# EAGLE design EagleVersion1.PowerPatch (EAGLE 9.6.2)
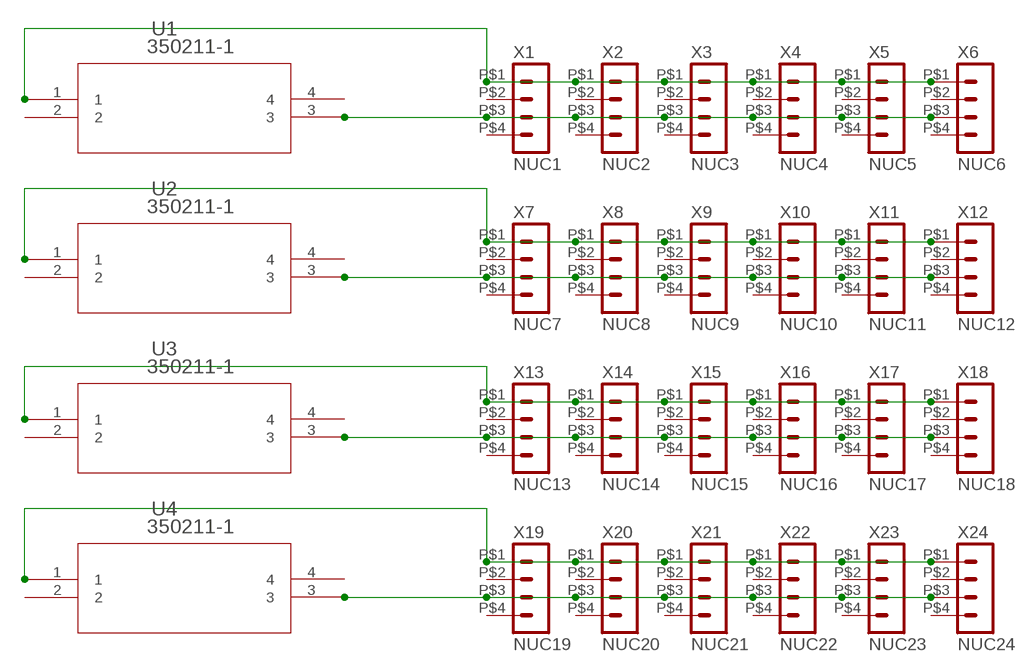
[diagram p0: schematic, sheet 1]

## Parts
U1  350211-1  [350211-1]
U2  350211-1  [350211-1]
U3  350211-1  [350211-1]
U4  350211-1  [350211-1]
X1  NUC1  HEADER_POS4_43045-0412  [43045-0412]
X2  NUC2  HEADER_POS4_43045-0412  [43045-0412]
X3  NUC3  HEADER_POS4_43045-0412  [43045-0412]
X4  NUC4  HEADER_POS4_43045-0412  [43045-0412]
X5  NUC5  HEADER_POS4_43045-0412  [43045-0412]
X6  NUC6  HEADER_POS4_43045-0412  [43045-0412]
X7  NUC7  HEADER_POS4_43045-0412  [43045-0412]
X8  NUC8  HEADER_POS4_43045-0412  [43045-0412]
X9  NUC9  HEADER_POS4_43045-0412  [43045-0412]
X10  NUC10  HEADER_POS4_43045-0412  [43045-0412]
X11  NUC11  HEADER_POS4_43045-0412  [43045-0412]
X12  NUC12  HEADER_POS4_43045-0412  [43045-0412]
X13  NUC13  HEADER_POS4_43045-0412  [43045-0412]
X14  NUC14  HEADER_POS4_43045-0412  [43045-0412]
X15  NUC15  HEADER_POS4_43045-0412  [43045-0412]
X16  NUC16  HEADER_POS4_43045-0412  [43045-0412]
X17  NUC17  HEADER_POS4_43045-0412  [43045-0412]
X18  NUC18  HEADER_POS4_43045-0412  [43045-0412]
X19  NUC19  HEADER_POS4_43045-0412  [43045-0412]
X20  NUC20  HEADER_POS4_43045-0412  [43045-0412]
X21  NUC21  HEADER_POS4_43045-0412  [43045-0412]
X22  NUC22  HEADER_POS4_43045-0412  [43045-0412]
X23  NUC23  HEADER_POS4_43045-0412  [43045-0412]
X24  NUC24  HEADER_POS4_43045-0412  [43045-0412]

## Nets
N$1: U1.1 X1.P$1 X2.P$1 X3.P$1 X4.P$1 X5.P$1 X6.P$1
N$2: U1.3 X1.P$3 X2.P$3 X3.P$3 X4.P$3 X5.P$3 X6.P$3
N$3: U2.1 X7.P$1 X8.P$1 X9.P$1 X10.P$1 X11.P$1 X12.P$1
N$4: U2.3 X7.P$3 X8.P$3 X9.P$3 X10.P$3 X11.P$3 X12.P$3
N$5: U3.1 X13.P$1 X14.P$1 X15.P$1 X16.P$1 X17.P$1 X18.P$1
N$6: U3.3 X13.P$3 X14.P$3 X15.P$3 X16.P$3 X17.P$3 X18.P$3
N$7: U4.1 X19.P$1 X20.P$1 X21.P$1 X22.P$1 X23.P$1 X24.P$1
N$8: U4.3 X19.P$3 X20.P$3 X21.P$3 X22.P$3 X23.P$3 X24.P$3
Unconnected: U1.2 U1.4 U2.2 U2.4 U3.2 U3.4 U4.2 U4.4 X1.P$2 X1.P$4 X2.P$2 X2.P$4 X3.P$2 X3.P$4 X4.P$2 X4.P$4 X5.P$2 X5.P$4 X6.P$2 X6.P$4 X7.P$2 X7.P$4 X8.P$2 X8.P$4 X9.P$2 X9.P$4 X10.P$2 X10.P$4 X11.P$2 X11.P$4 X12.P$2 X12.P$4 X13.P$2 X13.P$4 X14.P$2 X14.P$4 X15.P$2 X15.P$4 X16.P$2 X16.P$4 X17.P$2 X17.P$4 X18.P$2 X18.P$4 X19.P$2 X19.P$4 X20.P$2 X20.P$4 X21.P$2 X21.P$4 X22.P$2 X22.P$4 X23.P$2 X23.P$4 X24.P$2 X24.P$4

## Library data of the parts
U1-U4 = 350211-1:350211-1; COPYRIGHT: Copyright C 2015 Accelerated Designs. All rights reserved; MANUFACTURER_PART_NUMBER: 3502111; VENDOR: Tyco Electronics
X1-X24 = con-molex-micro-fit-3_0:HEADER_POS4_?: Molex - Micro-Fit 3.0 Series connector, 3.00mm (0.118") pitch header, 4 positions.

## Net classes
0 default: width 1 mm, clearance 0.205 mm

## Board
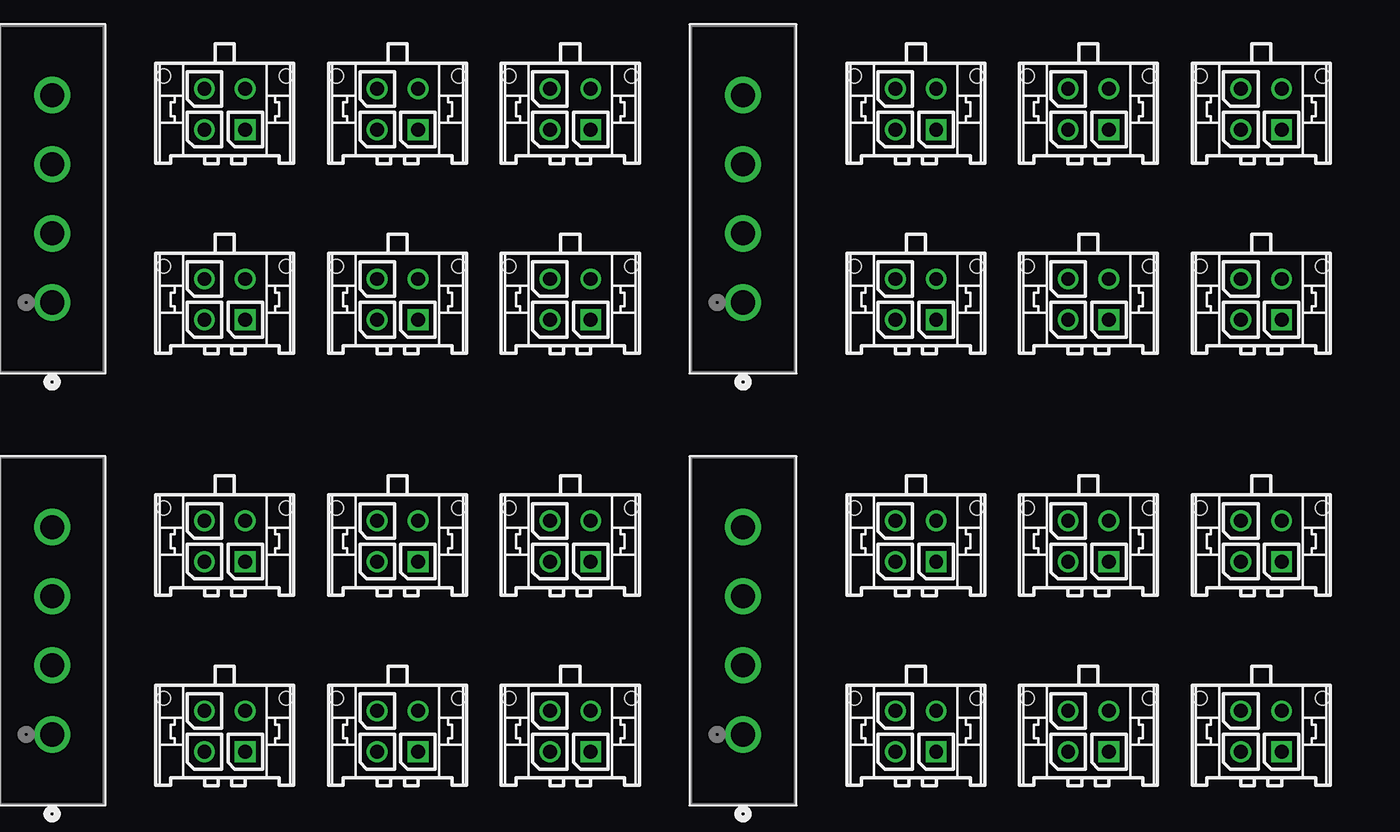
[diagram p1: board, top side]
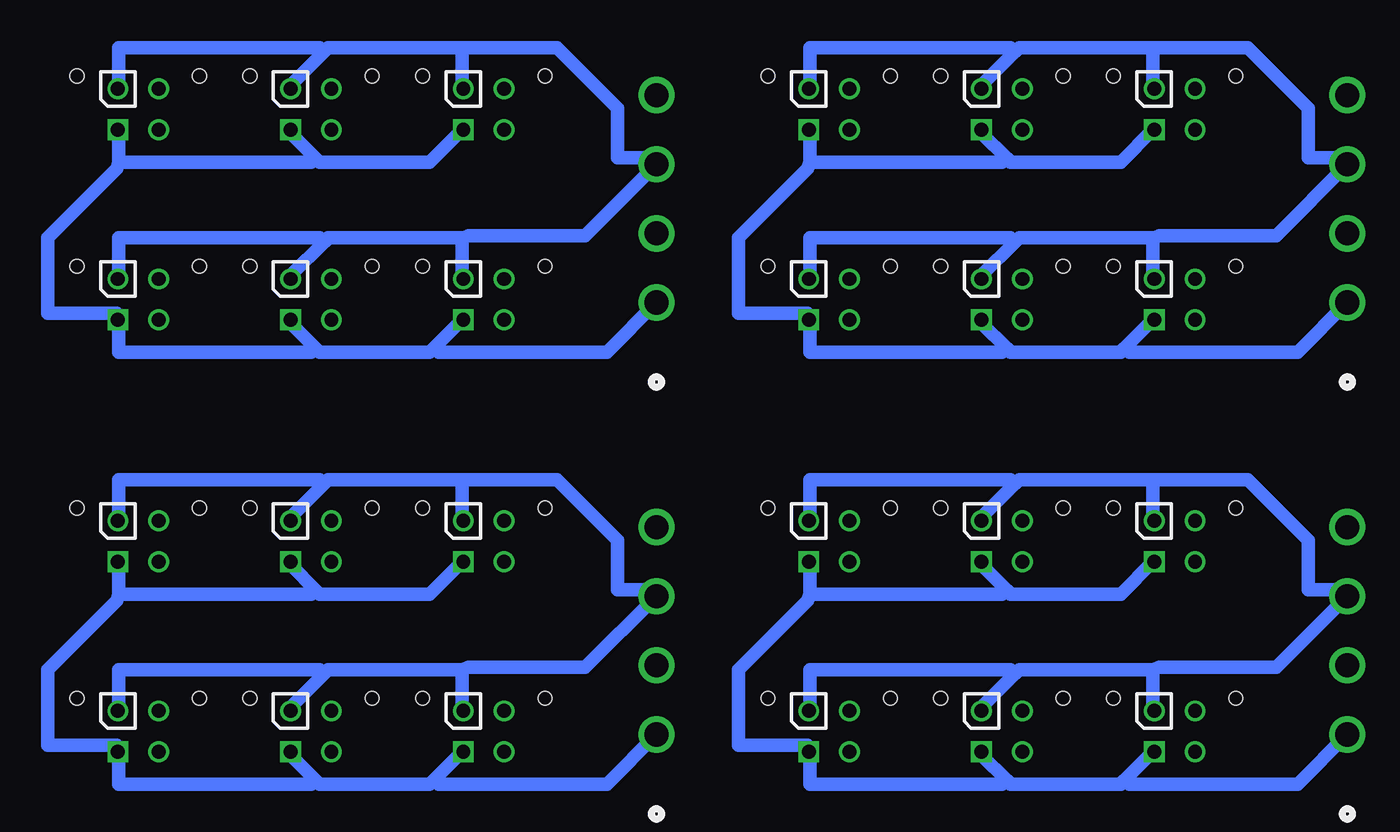
[diagram p2: board, bottom side, seen from below]

No outline drawn. Coordinates in mm, seen from the top.
Copper layers (1*16): Top 0mil / dielectric 1.5mm / Bottom 0.035mm
Design rules "default *": minimum track width 10mil, minimum drill 24mil, track to track 40mil, track to pad 40mil, pad to pad 40mil, via to via 40mil, smd to smd 8mil, copper to edge 40mil, drill to drill 8mil, minimum pad ring 10mil, minimum via ring 8mil, stop-mask expansion 4mil, vias tented up to drill 0mil, thermal gap 10mil

### Footprints (pad centres in the part's own frame; a part is rotated, then mirrored left to right if it is on the bottom)
350211-1 = drill 1.778 pad 2.286: 1 0,0; 2 5.08,0; 3 10.16,0; 4 15.24,0
43045-0412 = drill 1.02 square: P$1 1.5,0 | drill 1.02: P$2 -1.5,0; P$3 1.5,3; P$4 -1.5,3 | hole 1.02: 4.5,3.94; -4.5,3.94

### Placement (x,y rotation side)
U1  8.89,6.35 90 top
U2  59.69,6.35 90 top
U3  8.89,38.1 90 top
U4  59.69,38.1 90 top
X1  21.59,5.08 0 top
X2  34.29,5.08 0 top
X3  46.99,5.08 0 top
X4  46.99,19.05 0 top
X5  34.29,19.05 0 top
X6  21.59,19.05 0 top
X7  72.39,5.08 0 top
X8  85.09,5.08 0 top
X9  97.79,5.08 0 top
X10  97.79,19.05 0 top
X11  85.09,19.05 0 top
X12  72.39,19.05 0 top
X13  21.59,36.83 0 top
X14  34.29,36.83 0 top
X15  46.99,36.83 0 top
X16  46.99,50.8 0 top
X17  34.29,50.8 0 top
X18  21.59,50.8 0 top
X19  72.39,36.83 0 top
X20  85.09,36.83 0 top
X21  97.79,36.83 0 top
X22  97.79,50.8 0 top
X23  85.09,50.8 0 top
X24  72.39,50.8 0 top

### Tracks (layer width: path | path; a pad name or v marks a point on that pad's centre or on a via)
N$1
  Bottom 1: 33.97,16.99 35.72,18.73 35.72,19.05 X5.P$1 | 33.97,16.99 33.66,16.67 25.56,16.67 23.18,19.05 X6.P$1 | 48.42,16.67 48.42,19.05 X4.P$1 | 48.42,16.67 34.29,16.67 33.97,16.99 | 25.24,3.02 25.56,2.7 33.66,2.7 33.97,3.02 | 25.24,3.02 23.18,5.08 X1.P$1 | 33.97,3.02 35.72,4.76 35.72,5.08 X2.P$1 | 33.97,3.02 34.29,2.7 48.42,2.7 48.42,5.08 X3.P$1 48.58,5.56 53.66,5.56 53.66,11.11 48.58,16.19 48.42,16.67 | U1.1 12.54,2.7 24.92,2.7 25.24,3.02
N$2
  Bottom 1: 23.18,25.08 23.18,22.07 X6.P$3 | 23.18,25.08 33.02,25.08 33.34,24.77 | 33.34,24.77 35.72,22.38 35.72,22.07 X5.P$3 | X4.P$3 48.42,22.07 48.42,25.08 33.66,25.08 33.34,24.77 | 23.18,11.11 23.18,8.1 X1.P$3 | 23.18,11.11 33.02,11.11 33.34,10.79 | 33.34,10.79 35.72,8.41 35.72,8.1 X2.P$3 | X3.P$3 48.42,8.1 48.42,11.11 33.66,11.11 33.34,10.79 | 23.18,11.11 22.7,11.27 14.13,11.27 U1.3 9.05,16.99 11.75,16.99 11.75,20.64 16.19,25.08 23.18,25.08
N$3
  Bottom 1: 84.77,16.99 86.52,18.73 86.52,19.05 X11.P$1 | 84.77,16.99 84.45,16.67 76.36,16.67 73.98,19.05 X12.P$1 | 99.22,16.67 99.22,19.05 X10.P$1 | 99.22,16.67 85.09,16.67 84.77,16.99 | 76.04,3.02 76.36,2.7 84.45,2.7 84.77,3.02 | 76.04,3.02 73.98,5.08 X7.P$1 | 84.77,3.02 86.52,4.76 86.52,5.08 X8.P$1 | 84.77,3.02 85.09,2.7 99.22,2.7 99.22,5.08 X9.P$1 99.38,5.56 104.46,5.56 104.46,11.11 99.38,16.19 99.22,16.67 | U2.1 63.34,2.7 75.72,2.7 76.04,3.02
N$4
  Bottom 1: 73.98,25.08 73.98,22.07 X12.P$3 | 73.98,25.08 83.82,25.08 84.14,24.77 | 84.14,24.77 86.52,22.38 86.52,22.07 X11.P$3 | X10.P$3 99.22,22.07 99.22,25.08 84.45,25.08 84.14,24.77 | 73.98,11.11 73.98,8.1 X7.P$3 | 73.98,11.11 83.82,11.11 84.14,10.79 | 84.14,10.79 86.52,8.41 86.52,8.1 X8.P$3 | X9.P$3 99.22,8.1 99.22,11.11 84.45,11.11 84.14,10.79 | 73.98,11.11 73.5,11.27 64.93,11.27 U2.3 59.85,16.99 62.55,16.99 62.55,20.64 66.99,25.08 73.98,25.08
N$5
  Bottom 1: 33.97,48.74 35.72,50.48 35.72,50.8 X17.P$1 | 33.97,48.74 33.66,48.42 25.56,48.42 23.18,50.8 X18.P$1 | 48.42,48.42 48.42,50.8 X16.P$1 | 48.42,48.42 34.29,48.42 33.97,48.74 | 25.24,34.77 25.56,34.45 33.66,34.45 33.97,34.77 | 25.24,34.77 23.18,36.83 X13.P$1 | 33.97,34.77 35.72,36.51 35.72,36.83 X14.P$1 | 33.97,34.77 34.29,34.45 48.42,34.45 48.42,36.83 X15.P$1 48.58,37.31 53.66,37.31 53.66,42.86 48.58,47.94 48.42,48.42 | U3.1 12.54,34.45 24.92,34.45 25.24,34.77
N$6
  Bottom 1: 23.18,56.83 23.18,53.82 X18.P$3 | 23.18,56.83 33.02,56.83 33.34,56.52 | 33.34,56.52 35.72,54.13 35.72,53.82 X17.P$3 | X16.P$3 48.42,53.82 48.42,56.83 33.66,56.83 33.34,56.52 | 23.18,42.86 23.18,39.85 X13.P$3 | 23.18,42.86 33.02,42.86 33.34,42.55 | 33.34,42.55 35.72,40.16 35.72,39.85 X14.P$3 | X15.P$3 48.42,39.85 48.42,42.86 33.66,42.86 33.34,42.55 | 23.18,42.86 22.7,43.02 14.13,43.02 U3.3 9.05,48.74 11.75,48.74 11.75,52.39 16.19,56.83 23.18,56.83
N$7
  Bottom 1: 84.77,48.74 86.52,50.48 86.52,50.8 X23.P$1 | 84.77,48.74 84.45,48.42 76.36,48.42 73.98,50.8 X24.P$1 | 99.22,48.42 99.22,50.8 X22.P$1 | 99.22,48.42 85.09,48.42 84.77,48.74 | 76.04,34.77 76.36,34.45 84.45,34.45 84.77,34.77 | 76.04,34.77 73.98,36.83 X19.P$1 | 84.77,34.77 86.52,36.51 86.52,36.83 X20.P$1 | 84.77,34.77 85.09,34.45 99.22,34.45 99.22,36.83 X21.P$1 99.38,37.31 104.46,37.31 104.46,42.86 99.38,47.94 99.22,48.42 | U4.1 63.34,34.45 75.72,34.45 76.04,34.77
N$8
  Bottom 1: 73.98,56.83 73.98,53.82 X24.P$3 | 73.98,56.83 83.82,56.83 84.14,56.52 | 84.14,56.52 86.52,54.13 86.52,53.82 X23.P$3 | X22.P$3 99.22,53.82 99.22,56.83 84.45,56.83 84.14,56.52 | 73.98,42.86 73.98,39.85 X19.P$3 | 73.98,42.86 83.82,42.86 84.14,42.55 | 84.14,42.55 86.52,40.16 86.52,39.85 X20.P$3 | X21.P$3 99.22,39.85 99.22,42.86 84.45,42.86 84.14,42.55 | 73.98,42.86 73.5,43.02 64.93,43.02 U4.3 59.85,48.74 62.55,48.74 62.55,52.39 66.99,56.83 73.98,56.83